# EAGLE design PicoMCU (EAGLE 5.07)
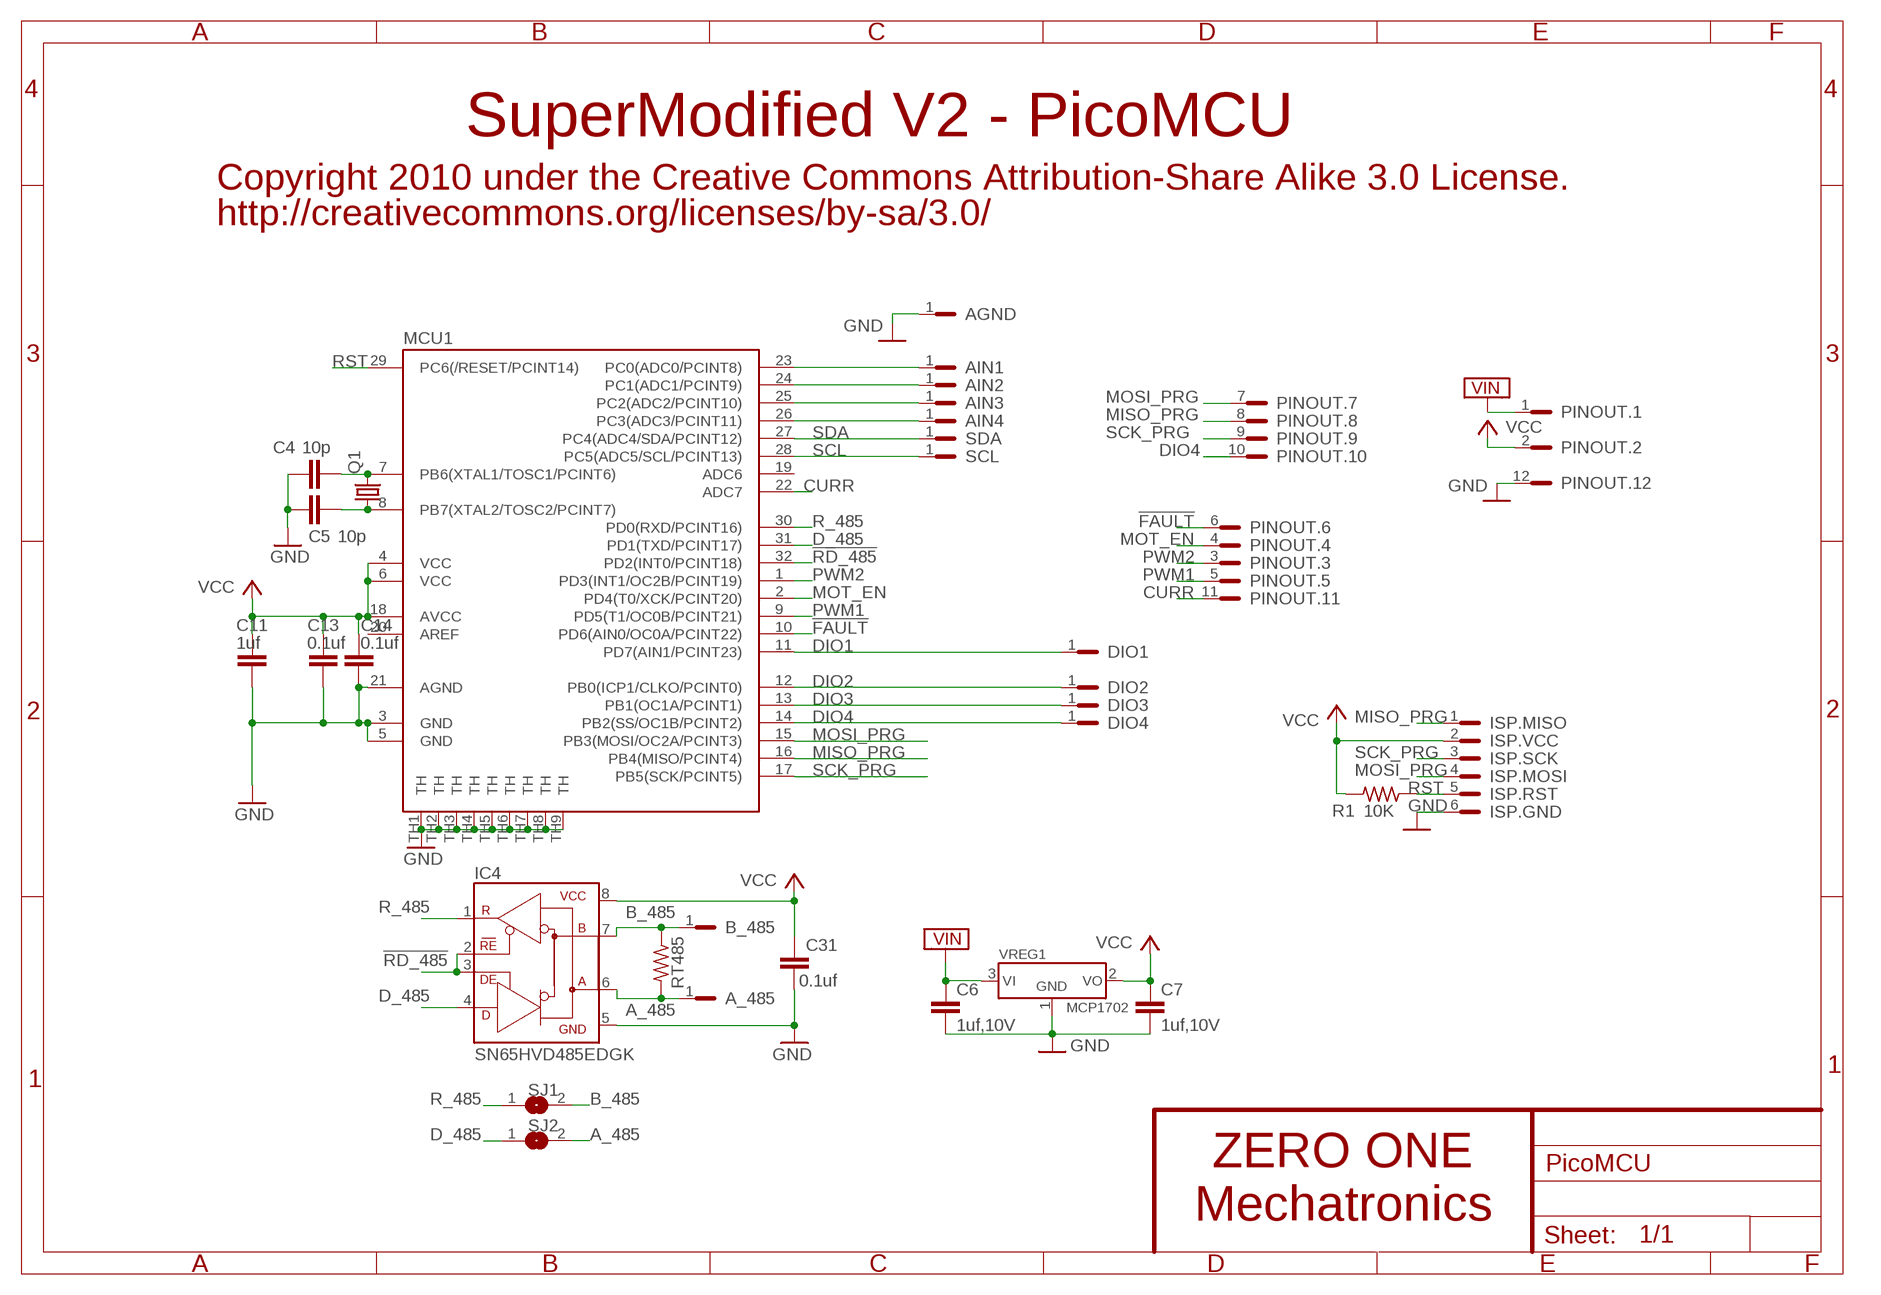
[diagram p0: schematic, sheet 1]

## Parts
A_485  BOTTOMPAD  [SMD_BOTTOM_PAD]
AGND  BOTTOMPAD  [SMD_BOTTOM_PAD]
AIN1  BOTTOMPAD  [SMD_BOTTOM_PAD]
AIN2  BOTTOMPAD  [SMD_BOTTOM_PAD]
AIN3  BOTTOMPAD  [SMD_BOTTOM_PAD]
AIN4  BOTTOMPAD  [SMD_BOTTOM_PAD]
B_485  BOTTOMPAD  [SMD_BOTTOM_PAD]
C4  10p  C-EUC0402K  [C0402K]
C5  10p  C-EUC0402K  [C0402K]
C6  1uf,10V  C-EUC0603K  [C0603K]
C7  1uf,10V  C-EUC0603K  [C0603K]
C11  1uf  C-EUC0603K  [C0603K]
C13  0.1uf  C-EUC0402K  [C0402K]
C14  0.1uf  C-EUC0402K  [C0402K]
C31  0.1uf  C-EUC0402K  [C0402K]
DIO1  BOTTOMPAD  [SMD_BOTTOM_PAD]
DIO2  BOTTOMPAD  [SMD_BOTTOM_PAD]
DIO3  BOTTOMPAD  [SMD_BOTTOM_PAD]
DIO4  BOTTOMPAD  [SMD_BOTTOM_PAD]
IC4  SN65HVD485EDGK  [MSOP8]
ISP  PROGRAMMER  [PADHEADER8TOPBOTTOM]
MCU1  ATMEGA48/88/168/328P  [MFL32TH]
PINOUT  SMSPINS  [SMSPINS]
Q1  CRYTALSMD2X2.5  [SMD2.5X2MM]
R1  10K  R-US_R0402  [R0402]
RT485  R-US_R1206  [R1206]
SCL  BOTTOMPAD  [SMD_BOTTOM_PAD]
SDA  BOTTOMPAD  [SMD_BOTTOM_PAD]
SJ1  SJ  [SJ]
SJ2  SJ  [SJ]
VREG1  MCP1702  [SOT23-3]

## Nets
!FAULT: MCU1.10(PD6(AIN0/OC0A/PCINT22)) PINOUT.6
!RD_485: IC4.2(!RE) IC4.3(DE) MCU1.32(PD2(INT0/PCINT18))
A_485: A_485.1 IC4.6(A) RT485.2 SJ2.2
AIN1: AIN1.1 MCU1.23(PC0(ADC0/PCINT8))
AIN2: AIN2.1 MCU1.24(PC1(ADC1/PCINT9))
AIN3: AIN3.1 MCU1.25(PC2(ADC2/PCINT10))
AIN4: AIN4.1 MCU1.26(PC3(ADC3/PCINT11))
B_485: B_485.1 IC4.7(B) RT485.1 SJ1.2
CURR: MCU1.22(ADC7) PINOUT.11
D_485: IC4.4(D) MCU1.31(PD1(TXD/PCINT17)) SJ2.1
DIO1: DIO1.1 MCU1.11(PD7(AIN1/PCINT23))
DIO2: DIO2.1 MCU1.12(PB0(ICP1/CLKO/PCINT0))
DIO3: DIO3.1 MCU1.13(PB1(OC1A/PCINT1))
DIO4: DIO4.1 MCU1.14(PB2(SS/OC1B/PCINT2)) PINOUT.10
GND: AGND.1 C4.1 C5.1 C6.2 C7.2 C11.2 C13.2 C14.2 C31.2 IC4.5(GND) ISP.6 MCU1.3(GND) MCU1.5(GND) MCU1.21(AGND) MCU1.TH1(TH) MCU1.TH2(TH) MCU1.TH3(TH) MCU1.TH4(TH) MCU1.TH5(TH) MCU1.TH6(TH) MCU1.TH7(TH) MCU1.TH8(TH) MCU1.TH9(TH) PINOUT.12 VREG1.1(GND)
MISO_PRG: ISP.1 MCU1.16(PB4(MISO/PCINT4)) PINOUT.8
MOSI_PRG: ISP.4 MCU1.15(PB3(MOSI/OC2A/PCINT3)) PINOUT.7
MOT_EN: MCU1.2(PD4(T0/XCK/PCINT20)) PINOUT.4
N$17: C4.2 MCU1.7(PB6(XTAL1/TOSC1/PCINT6)) Q1.3
N$18: C5.2 MCU1.8(PB7(XTAL2/TOSC2/PCINT7)) Q1.1
PWM1: MCU1.9(PD5(T1/OC0B/PCINT21)) PINOUT.5
PWM2: MCU1.1(PD3(INT1/OC2B/PCINT19)) PINOUT.3
R_485: IC4.1(R) MCU1.30(PD0(RXD/PCINT16)) SJ1.1
RST: ISP.5 MCU1.29(PC6(/RESET/PCINT14)) R1.1
SCK_PRG: ISP.3 MCU1.17(PB5(SCK/PCINT5)) PINOUT.9
SCL: MCU1.28(PC5(ADC5/SCL/PCINT13)) SCL.1
SDA: MCU1.27(PC4(ADC4/SDA/PCINT12)) SDA.1
VCC: C7.1 C11.1 C13.1 C14.1 C31.1 IC4.8(VCC) ISP.2 MCU1.4(VCC) MCU1.6(VCC) MCU1.18(AVCC) PINOUT.2 R1.2 VREG1.2(VO)
VIN: C6.1 PINOUT.1 VREG1.3(VI)
Unconnected: MCU1.19(ADC6) MCU1.20(AREF)

## Notes on the sheet
- SuperModified V2 - PicoMCU
- Copyright 2010 under the Creative Commons Attribution-Share Alike 3.0 License.
- http://creativecommons.org/licenses/by-sa/3.0/
- ZERO ONE
- Mechatronics

## Library data of the parts
A_485 AGND AIN1-AIN4 B_485 DIO1-DIO4 SCL SDA = sms:BOTTOMPAD
C4-C7 C11 C13 C14 C31 = rcl:C-EU: CAPACITOR, European symbol
IC4 = zo_TMS320DMC:SN65HVD485E
ISP = sms:PROGRAMMER
MCU1 = sms:ATMEGA48/88/168/328P
PINOUT = sms:SMSPINS
Q1 = crystal:CRYTAL: CRYSTAL
R1 RT485 = rcl:R-US_: RESISTOR, American symbol
SJ1 SJ2 = sms:SJ
VREG1 = zo_TMS320DMC:MCP1702

## Board
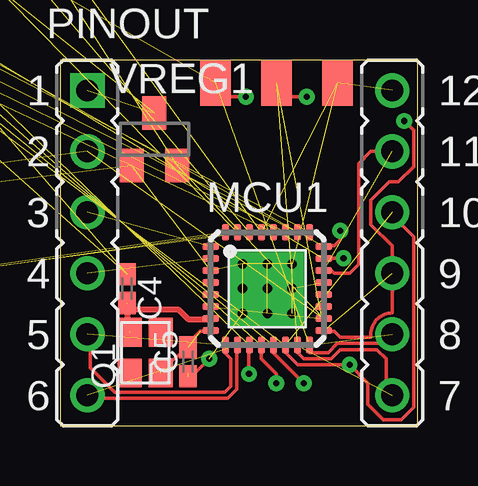
[diagram p1: board, top side]
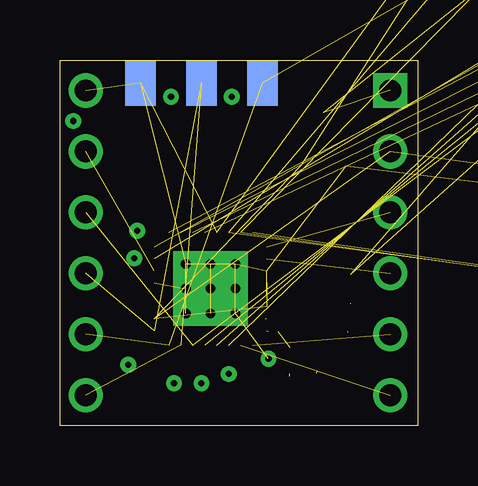
[diagram p2: board, bottom side, seen from below]

Size 14.91 x 15.23 mm. Coordinates in mm from the lower left corner, seen from the top.
Outline: 0,0 14.91,0 14.91,15.23 0,15.23 0,0
Copper layers (1*16): Top 0.035mm / dielectric 1.5mm / Bottom 0.035mm
Design rules "default": minimum track width 10mil, minimum drill 24mil, track to track 8mil, track to pad 8mil, pad to pad 8mil, via to via 8mil, smd to smd 8mil, copper to edge 40mil, drill to drill 8mil, minimum pad ring 10mil, minimum via ring 8mil, stop-mask expansion 4mil, vias tented up to drill 0mil, thermal gap 10mil

### Footprints (pad centres in the part's own frame; a part is rotated, then mirrored left to right if it is on the bottom)
SMD_BOTTOM_PAD = smd 1.27 x 1.905 bottom: 1 0,0
C0402K = smd 0.925 x 0.74: 1 -0.6,0; 2 0.6,0
C0603K = smd 1.05 x 1.08: 1 -0.875,0; 2 0.875,0
MSOP8 = smd 0.3 x 1.2: 1 -0.976,-2.113; 2 -0.326,-2.113; 3 0.324,-2.113; 4 0.974,-2.113; 5 0.974,2.112; 6 0.324,2.112; 7 -0.326,2.112; 8 -0.976,2.112
PADHEADER8TOPBOTTOM = smd 1.27 x 1.905: 1 -2.54,-0.953; 3 0,-0.953; 5 2.54,-0.953 | smd 1.27 x 1.905 bottom: 2 -2.54,-0.953; 4 0,-0.953; 6 2.54,-0.953
MFL32TH = smd 0.698 x 0.292: 1 -2.35,1.75; 2 -2.35,1.25; 3 -2.35,0.75; 4 -2.35,0.25; 5 -2.35,-0.25; 6 -2.35,-0.75; 7 -2.35,-1.25; 8 -2.35,-1.75; 17 2.35,-1.75; 18 2.35,-1.25; 19 2.35,-0.75; 20 2.35,-0.25; 21 2.35,0.25; 22 2.35,0.75; 23 2.35,1.25; 24 2.35,1.75 | smd 0.292 x 0.698: 9 -1.75,-2.35; 10 -1.25,-2.35; 11 -0.75,-2.35; 12 -0.25,-2.35; 13 0.25,-2.35; 14 0.75,-2.35; 15 1.25,-2.35; 16 1.75,-2.35; 25 1.75,2.35; 26 1.25,2.35; 27 0.75,2.35; 28 0.25,2.35; 29 -0.25,2.35; 30 -0.75,2.35; 31 -1.25,2.35; 32 -1.75,2.35 | drill 0.4 pad 1.033 square: TH1 -1.032,1.032; TH2 0.002,1.032; TH3 1.035,1.032; TH4 -1.032,-0.002; TH5 0.002,-0.002; TH6 1.035,-0.002; TH7 -1.032,-1.035; TH8 0.002,-1.035; TH9 1.035,-1.035
SMSPINS = drill 0.914 square: 1 -6.35,6.35 | drill 0.914 round: 2 -6.35,3.81; 3 -6.35,1.27; 4 -6.35,-1.27; 5 -6.35,-3.81; 6 -6.35,-6.35; 7 6.35,-6.35; 8 6.35,-3.81; 9 6.35,-1.27; 10 6.35,1.27; 11 6.35,3.81; 12 6.35,6.35
SMD2.5X2MM = smd 1.2 x 1: 1 -0.85,-0.65; 2 0.85,-0.65; 3 0.85,0.65; 4 -0.85,0.65
R0402 = smd 0.7 x 0.9: 1 -0.65,0; 2 0.65,0
R1206 = smd 1.6 x 1.803: 1 -1.422,0; 2 1.422,0
SJ = smd 0.7 x 0.9: 1 -0.46,0; 2 0.46,0
SOT23-3 = smd 1 x 1.4: 1 -0.95,-1.1; 2 0.95,-1.1; 3 0,1.1

### Placement (x,y rotation side)
A_485  -36.83,22.86 0 top  (outside the outline)
AGND  -41.91,22.86 0 top  (outside the outline)
AIN1  -34.29,34.29 0 top  (outside the outline)
AIN2  -36.83,34.29 0 top  (outside the outline)
AIN3  -39.37,34.29 0 top  (outside the outline)
AIN4  -41.91,34.29 0 top  (outside the outline)
B_485  -39.37,22.86 0 top  (outside the outline)
C4  2.79,5.71 270 top
C5  5.33,2.67 90 top
C6  -33.02,43.18 0 top  (outside the outline)
C7  -39.37,43.18 0 top  (outside the outline)
C11  -43.18,43.18 0 top  (outside the outline)
C13  -24.13,48.26 0 top  (outside the outline)
C14  -29.21,48.26 0 top  (outside the outline)
C31  -34.29,48.26 0 top  (outside the outline)
DIO1  -24.13,34.29 0 top  (outside the outline)
DIO2  -26.67,34.29 0 top  (outside the outline)
DIO3  -29.21,34.29 0 top  (outside the outline)
DIO4  -31.75,34.29 0 top  (outside the outline)
IC4  -38.1,3.81 0 top  (outside the outline)
ISP  9.02,15.24 0 top
MCU1  8.64,5.71 0 top
PINOUT  7.49,7.62 0 top
Q1  3.56,3.05 90 top
R1  -16.51,43.18 0 top  (outside the outline)
RT485  -17.78,46.99 0 top  (outside the outline)
SCL  -46.99,34.29 0 top  (outside the outline)
SDA  -44.45,34.29 0 top  (outside the outline)
SJ1  -21.59,43.18 0 top  (outside the outline)
SJ2  -26.67,43.18 0 top  (outside the outline)
VREG1  3.94,11.94 0 top

### Tracks (layer width: path | path; a pad name or v marks a point on that pad's centre or on a via)
!FAULT  (1 unrouted)
  Top 0.152: 7.37,3.3 7.37,1.52 6.99,1.14 1.91,1.14 1.27,1.14 PINOUT.6
!RD_485  (2 unrouted)
A_485  (3 unrouted)
AIN1  (1 unrouted)
AIN2  (1 unrouted)
AIN3  (1 unrouted)
AIN4  (1 unrouted)
B_485  (3 unrouted)
CURR  (1 unrouted)
  Top 0.152: 10.92,6.48 11.3,6.48 11.43,6.35 12.06,6.35 12.45,6.73 12.45,10.92 12.95,11.43 PINOUT.11
D_485  (2 unrouted)
DIO1  (1 unrouted)
DIO2  (1 unrouted)
DIO3  (1 unrouted)
DIO4  (via drill 0.25)  (2 unrouted)
  Top 0.152: 9.4,3.43 9.4,3.05 9.91,2.54 v12.06,2.54 12.83,1.78 12.83,0.89 13.46,0.25 14.22,0.25 14.73,0.76 14.73,7.87 13.84,8.76 PINOUT.10
GND  (via drill 0.25)  (25 unrouted)
  Top 0.152: 5.33,2.16 5.59,2.16 v6.22,2.79
MISO_PRG  (2 unrouted)
  Top 0.152: 10.41,3.43 10.41,3.05 11.18,3.05 11.56,3.43 13.59,3.43 PINOUT.8
MOSI_PRG  (2 unrouted)
  Top 0.152: 9.91,3.43 9.91,3.05 10.16,2.79 11.3,2.79 11.68,3.17 13.21,3.17 13.59,2.79 13.59,1.65 PINOUT.7
MOT_EN  (1 unrouted)
N$1  (via drill 0.25)
  Top 0.152: 9.02,14.22 9.53,13.72 v10.29,13.72
N$2  (via drill 0.25)
  Top 0.152: 6.48,14.35 7.11,13.72 v7.75,13.72
N$3  (via drill 0.25)
  Top 0.152: 7.87,3.3 v7.87,2.16
N$4  (via drill 0.25)
  Top 0.152: 11.05,6.99 v11.81,6.99
N$5  (via drill 0.25)
  Top 0.152: 8.89,3.43 8.89,3.05 v10.16,1.78
N$6  (via drill 0.25)
  Top 0.152: 8.38,3.3 8.38,2.79 9.02,2.16 v9.02,1.78
N$8  (via drill 0.25)
  Top 0.152: 11.05,7.49 11.43,7.49 11.68,7.75 v11.68,8.13
N$17  (3 unrouted)
  Top 0.254: 2.92,3.94 2.79,4.06 2.79,5.08 3.05,4.83 4.95,4.83 5.33,4.45 6.35,4.45
N$18  (3 unrouted)
  Top 0.152: 4.19,2.29 5.33,3.3 5.33,3.43 5.84,3.94 6.22,3.94
PWM1  (1 unrouted)
  Top 0.152: 6.86,3.3 6.86,3.05 7.11,2.79 7.11,1.65 6.86,1.4 2.29,1.4 1.27,2.41 1.27,3.68 PINOUT.5
PWM2  (1 unrouted)
R_485  (2 unrouted)
RST  (2 unrouted)
SCK_PRG  (via drill 0.25)  (2 unrouted)
  Top 0.152: 11.05,3.94 11.43,3.94 11.68,3.68 12.95,3.68 12.95,3.81 arc-90 13.84,4.7 PINOUT.9 13.84,7.49 12.95,8.38 12.95,9.4 13.72,10.16 14.1,10.16 14.73,10.79 14.73,12.32 v14.35,12.7
SCL  (1 unrouted)
SDA  (1 unrouted)
VCC  (12 unrouted)
VIN  (2 unrouted)